# Altium schematic sheet ESP32.SchDoc
size A4
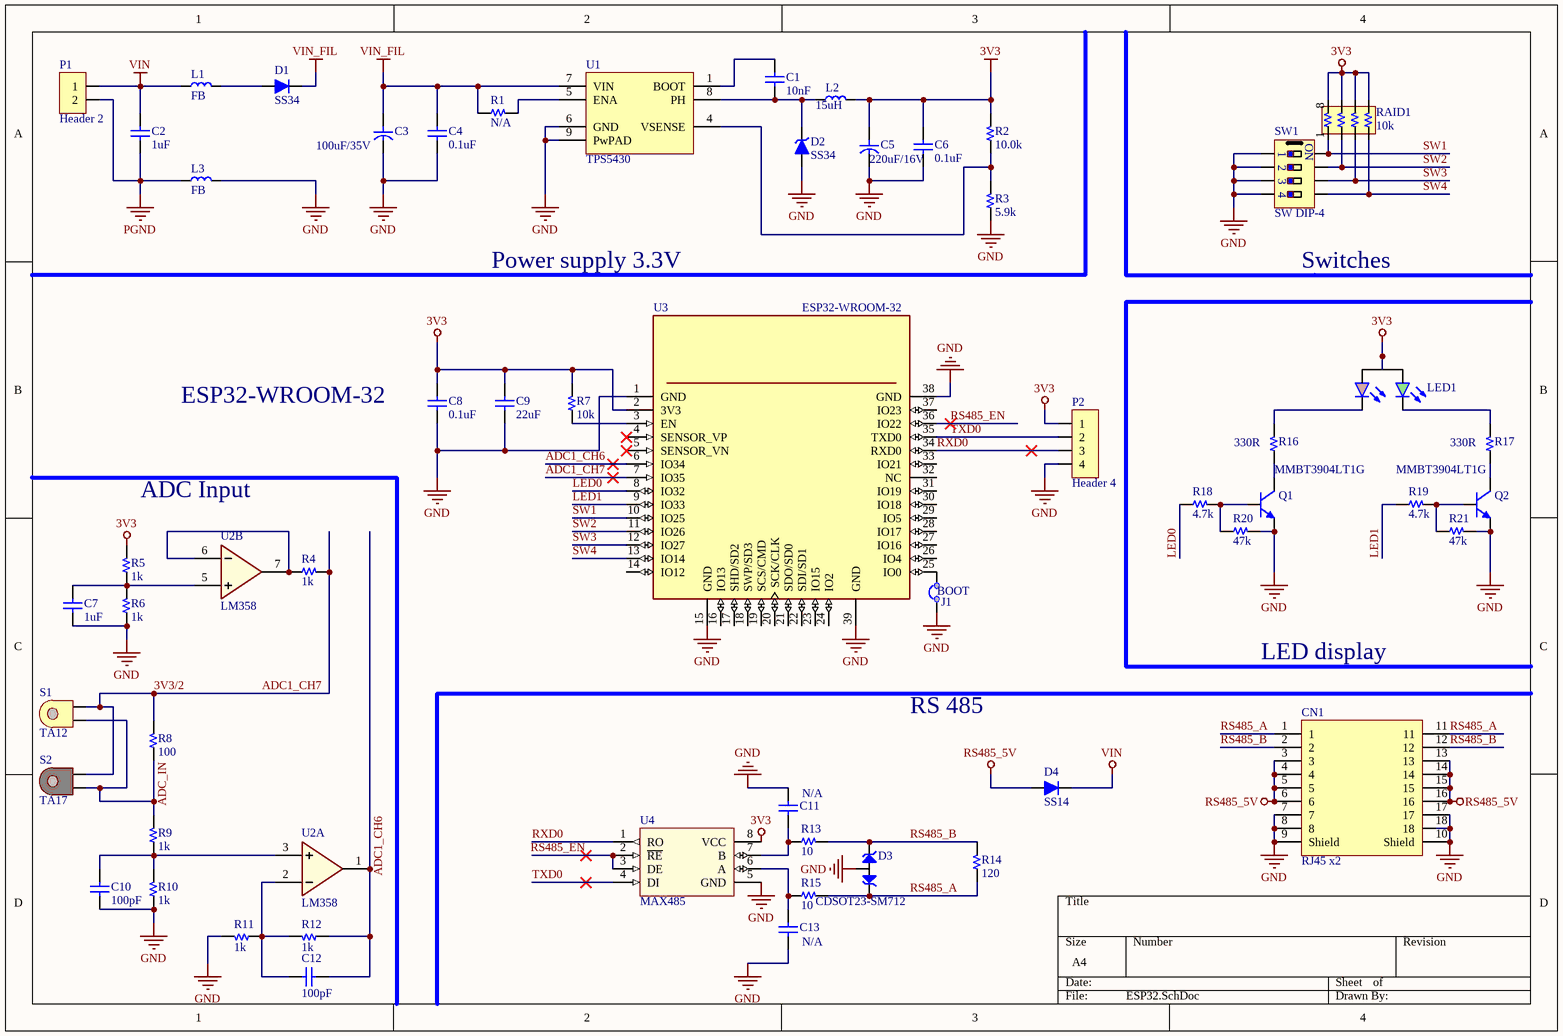
[diagram p0: ESP32.SchDoc]

## Parts
C1  10nF  [C 0603]
C2  1uF  [C 0805]
C3  100uF/35V  [C SMD ALU (D8)]
C4  0.1uF  [C 0603]
C5  220uF/16V  [C SMD ALU (D8)]
C6  0.1uF  [C 0603]
C7  1uF  [C 0603]
C8  0.1uF  [C 0603]
C9  22uF  [C 1210]
C10  100pF  [C 0603]
C11  N/A  [C 0603]
C12  100pF  [C 0603]
C13  N/A  [C 0603]
CN1  RJ45 x2  [CONN/RJ45/x2]
D1  SS34  [DO-214AC (SMA) L]
D2  SS34  [DO-214AC (SMA)]
D3  CDSOT23-SM712  [SOT-23]
D4  SS14  [DO-214AC (SMA) L]
J1  BOOT  [JUMP/2/SMD/0402]  (no BOM)
L1  FB  [L 0603 (1608)]
L2  15uH  [Inductor SMD CDRH3D67]
L3  FB  [L 0603 (1608)]
LED1  Led 3pin 2color  [LED 3PIN 2COLOR 5MM]  (value not drawn)
P1  Header 2  [HDR/Header/2/BOX]
P2  Header 4  [HDR/Header/4]
Q1  MMBT3904LT1G  [SOT-23]
Q2  MMBT3904LT1G  [SOT-23]
R1  N/A  [R 0805]
R2  10.0k  [R 0805]
R3  5.9k  [R 0805]
R4  1k  [R 1206]
R5  1k  [R 1206]
R6  1k  [R 1206]
R7  10k  [R 1206]
R8  100  [R 1206]
R9  1k  [R 1206]
R10  1k  [R 1206]
R11  1k  [R 1206]
R12  1k  [R 1206]
R13  10  [R 1206]
R14  120  [R 1206]
R15  10  [R 1206]
R16  330R  [R 1206]
R17  330R  [R 1206]
R18  4.7k  [R 1812]
R19  4.7k  [R 1812]
R20  47k  [R 1812]
R21  47k  [R 1812]
RAID1  10k  [RA4 1206 (3216)]
S1  TA12  [TA12]
S2  TA17  [TA17]
SW1  SW DIP-4  [SW/DIP4]
U1  TPS5430  [SOIC-8 EP]
U2  LM358  [SOIC-8]  (parts A,B of 2)
U3  ESP32-WROOM-32  [MODULE_ESP32-WROOM-32]
U4  MAX485  [SOIC-8]

## Nets
3V3: C5.1 C6.1 C8.1 C9.1 L2.2 LED1.2(A) P2.1 R2.2 R5.2 R7.2 RAID1.5 RAID1.6 RAID1.7 RAID1.8 U3.2(3V3) U4.8(VCC)
GND: C3.2 C4.2 C5.2 C6.2 C7.2 C8.2 C9.2 C10.2 C11.1 C13.2 CN1.7 CN1.8 CN1.9(Shield) CN1.10(Shield) CN1.17 CN1.18 D2.1(A) D3.3(COM) J1.1 L3.2 P2.4 Q1.2(E) Q2.2(E) R3.1 R6.1 R10.1 R11.2 R20.2 R21.2 SW1.1 SW1.2 SW1.3 SW1.4 U1.6(GND) U1.9(PwPAD) U2.4(GND) U3.1(GND) U3.15(GND) U3.38(GND) U3.39(GND) U4.5(GND)
PGND: C2.2 L3.1 P1.2
RS485_5V: CN1.3 CN1.4 CN1.5 CN1.6 CN1.13 CN1.14 CN1.15 CN1.16 D4.1(A)
VCC: U2.8(VCC)
VIN: C2.1 D4.2(K) L1.1 P1.1
VIN_FIL: C3.1 C4.1 D1.2(K) R1.1 U1.7(VIN)
3V3/2: R4.2 R8.2 S1.1 S2.1 U3.7(IO35)  [also labelled ADC1_CH7]
ADC1_CH6: C12.2 R12.1 U2.1(OutA) U3.6(IO34)
ADC_IN: R8.1 R9.2 S1.2 S2.2
LED0: R18.1 U3.8(IO32)
LED1: R19.1 U3.9(IO33)
RS485_A: CN1.1 CN1.11 D3.2(IO2) R14.1 R15.2
RS485_B: CN1.2 CN1.12 D3.1(IO1) R13.2 R14.2
RS485_EN: U3.36(IO22)
RXD0: P2.3 U3.34(RXD0) U4.1(RO)
SW1: RAID1.1 SW1.8 U3.10(IO25)
SW2: RAID1.2 SW1.7 U3.11(IO26)
SW3: RAID1.3 SW1.6 U3.12(IO27)
SW4: RAID1.4 SW1.5 U3.13(IO14)
TXD0: P2.2 U3.35(TXD0) U4.4(DI)
NetC1_1: C1.1 U1.1(BOOT)
NetC1_2: C1.2 D2.2(K) L2.1 U1.8(PH)
NetC7_1: C7.1 R5.1 R6.2 U2.5(B+)
NetC10_1: C10.1 R9.1 R10.2 U2.3(A+)
NetC11_2: C11.2 R13.1 U4.7(B)
NetC12_1: C12.1 R11.1 R12.2 U2.2(A-)
NetC13_1: C13.1 R15.1 U4.6(A)
NetD1_1: D1.1(A) L1.2
NetJ1_2: J1.2 U3.25(IO0)
NetLED1_1: LED1.1(RK) R16.2
NetLED1_3: LED1.3(YK) R17.2
NetQ1_1: Q1.1(B) R18.2 R20.1
NetQ1_3: Q1.3(C) R16.1
NetQ2_1: Q2.1(B) R19.2 R21.1
NetQ2_3: Q2.3(C) R17.1
NetR1_2: R1.2 U1.5(ENA)
NetR2_1: R2.1 R3.2 U1.4(VSENSE)
NetR4_1: R4.1 U2.6(B-) U2.7(OutB)
NetR7_1: R7.1 U3.3(EN)
NetU4_2: U4.2(~{RE}) U4.3(DE)

Not connected (* = marked no-connect by the designer): U3 4(SENSOR_VP)* 5(SENSOR_VN)* 14(IO12) 16(IO13) 17(SHD/SD2) 18(SWP/SD3) 19(SCS/CMD) 20(SCK/CLK) 21(SDO/SD0) 22(SDI/SD1) 23(IO15) 24(IO2) 26(IO4) 27(IO16) 28(IO17) 29(IO5) 30(IO18) 31(IO19) 32(NC) 33(IO21) 37(IO23)

## Notes on the sheet
- Power supply 3.3V
- Switches
- ESP32-WROOM-32
- ADC Input
- RS 485
- LED display
- Labels drawn without touching a wire or pin: RS485_EN
- (in symbol SW DIP-4) ON

## Library data of the parts
C1 C2 C4 C6-C13 = Capacitor NP: Capacitor non-pol
C3 C5 = Capacitor: Capacitor pol
CN1 = CON RJ45 x2: Connector RJ45 X2
D1 D4 = Diode: Default Diode
D2 = Diode Zener: Zener Diode
D3 = CDSOT23-SM712: TVS DIODE 7V/12V 14V/26V SOT23-3
J1 = JUMP 2
L1-L3 = Inductor
LED1 = Led 3pin 2color: Typical LED 3-pin 2-color
P1 = Header 2: Header, 2-Pin
P2 = Header 4: Header, 4-Pin
Q1 Q2 = Transistor NPN: NPN Bipolar Transistor
R1-R21 = Resistor
RAID1 = Resistor Array 4
U1 = TPS54xx: 3/5A, Wide input range, Step-down SWIFT DC-DC Converter
U2 = LM358: Low Power Dual Operational Amplifiers
U3 = ESP32-WROOM-32: Bluetooth, WiFi 802.11b/g/n, Bluetooth v4.2 + EDR, Class 1, 2 and 3 Transceiver Module 2.4GHz ~ 2.5GHz Integrated, Trace Surface Mount; MF: Espressif Systems; MP: ESP32-WROOM-32D; Price: None; Package: Module Espressif Systems; Availability: Unavailable; SnapEDA_Link: https://www.snapeda.com/parts/ESP32-WROOM-32D/Espressif%20Systems/view-part/2768115/?ref=snap; Value: *
U4 = MAX485: Low-Power, Slew-Rate-Limited  RS-485/RS-422 Transceivers